# Altium schematic sheet [06] - ADC.SchDoc
size A4; DocumentNumber: 7; SheetNumber: 7; SheetTotal: 9
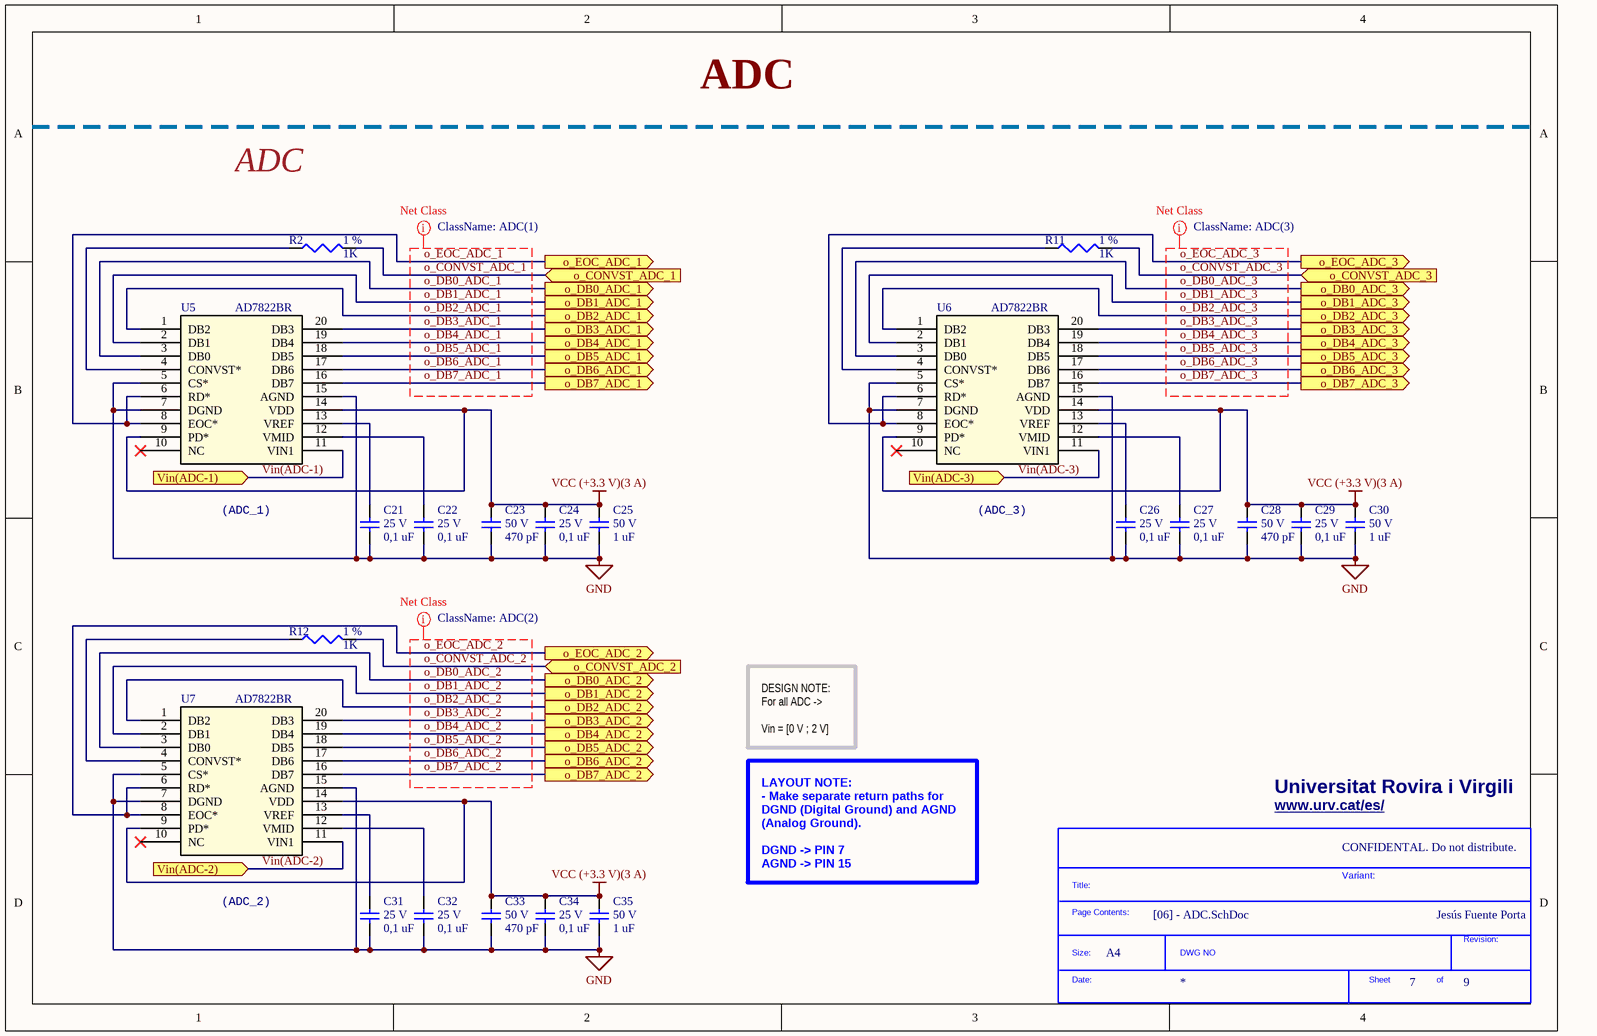
[diagram p0: [06] - ADC.SchDoc]

## Parts
*?  SDTitleBlock  (value not drawn)  (graphical)
C21  0,1 uF  Voltage: 25 V  [1206 [Métrica 3216]]
C22  0,1 uF  Voltage: 25 V  [1206 [Métrica 3216]]
C23  470 pF  Voltage: 50 V  [1206 [Métrica 3216]]
C24  0,1 uF  Voltage: 25 V  [1206 [Métrica 3216]]
C25  1 uF  Voltage: 50 V  [1206 [Métrica 3216]]
C26  0,1 uF  Voltage: 25 V  [1206 [Métrica 3216]]
C27  0,1 uF  Voltage: 25 V  [1206 [Métrica 3216]]
C28  470 pF  Voltage: 50 V  [1206 [Métrica 3216]]
C29  0,1 uF  Voltage: 25 V  [1206 [Métrica 3216]]
C30  1 uF  Voltage: 50 V  [1206 [Métrica 3216]]
C31  0,1 uF  Voltage: 25 V  [1206 [Métrica 3216]]
C32  0,1 uF  Voltage: 25 V  [1206 [Métrica 3216]]
C33  470 pF  Voltage: 50 V  [1206 [Métrica 3216]]
C34  0,1 uF  Voltage: 25 V  [1206 [Métrica 3216]]
C35  1 uF  Voltage: 50 V  [1206 [Métrica 3216]]
R2  1 %  value 1K  [1206 [Métrica 3216]]
R11  1 %  value 1K  [1206 [Métrica 3216]]
R12  1 %  value 1K  [1206 [Métrica 3216]]
U5  AD7822BR  [RW_20-M (AD7822BR)]
U6  AD7822BR  [RW_20-M (AD7822BR)]
U7  AD7822BR  [RW_20-M (AD7822BR)]

## Ports
o_CONVST_ADC_1 (in), o_CONVST_ADC_2 (in), o_CONVST_ADC_3 (in), o_DB0_ADC_1 (out), o_DB0_ADC_2 (out), o_DB0_ADC_3 (out), o_DB1_ADC_1 (out), o_DB1_ADC_2 (out), o_DB1_ADC_3 (out), o_DB2_ADC_1 (out), o_DB2_ADC_2 (out), o_DB2_ADC_3 (out), o_DB3_ADC_1 (out), o_DB3_ADC_2 (out), o_DB3_ADC_3 (out), o_DB4_ADC_1 (out), o_DB4_ADC_2 (out), o_DB4_ADC_3 (out), o_DB5_ADC_1 (out), o_DB5_ADC_2 (out), o_DB5_ADC_3 (out), o_DB6_ADC_1 (out), o_DB6_ADC_2 (out), o_DB6_ADC_3 (out), o_DB7_ADC_1 (out), o_DB7_ADC_2 (out), o_DB7_ADC_3 (out), o_EOC_ADC_1 (out), o_EOC_ADC_2 (out), o_EOC_ADC_3 (out), Vin(ADC-1) (in), Vin(ADC-2) (in), Vin(ADC-3) (in)

## Nets
GND: C21.2 C22.2 C23.2 C24.2 C25.2 C26.2 C27.2 C28.2 C29.2 C30.2 C31.2 C32.2 C33.2 C34.2 C35.2 U5.5(CS*) U5.7(DGND) U5.15(AGND) U6.5(CS*) U6.7(DGND) U6.15(AGND) U7.5(CS*) U7.7(DGND) U7.15(AGND)
VCC (+3.3 V)(3 A): C23.1 C24.1 C25.1 C28.1 C29.1 C30.1 C33.1 C34.1 C35.1 U5.9(PD*) U5.14(VDD) U6.9(PD*) U6.14(VDD) U7.9(PD*) U7.14(VDD)
o_CONVST_ADC_1: R2.2 ; port o_CONVST_ADC_1
o_CONVST_ADC_2: R12.2 ; port o_CONVST_ADC_2
o_CONVST_ADC_3: R11.2 ; port o_CONVST_ADC_3
o_DB0_ADC_1: U5.3(DB0) ; port o_DB0_ADC_1
o_DB0_ADC_2: U7.3(DB0) ; port o_DB0_ADC_2
o_DB0_ADC_3: U6.3(DB0) ; port o_DB0_ADC_3
o_DB1_ADC_1: U5.2(DB1) ; port o_DB1_ADC_1
o_DB1_ADC_2: U7.2(DB1) ; port o_DB1_ADC_2
o_DB1_ADC_3: U6.2(DB1) ; port o_DB1_ADC_3
o_DB2_ADC_1: U5.1(DB2) ; port o_DB2_ADC_1
o_DB2_ADC_2: U7.1(DB2) ; port o_DB2_ADC_2
o_DB2_ADC_3: U6.1(DB2) ; port o_DB2_ADC_3
o_DB3_ADC_1: U5.20(DB3) ; port o_DB3_ADC_1
o_DB3_ADC_2: U7.20(DB3) ; port o_DB3_ADC_2
o_DB3_ADC_3: U6.20(DB3) ; port o_DB3_ADC_3
o_DB4_ADC_1: U5.19(DB4) ; port o_DB4_ADC_1
o_DB4_ADC_2: U7.19(DB4) ; port o_DB4_ADC_2
o_DB4_ADC_3: U6.19(DB4) ; port o_DB4_ADC_3
o_DB5_ADC_1: U5.18(DB5) ; port o_DB5_ADC_1
o_DB5_ADC_2: U7.18(DB5) ; port o_DB5_ADC_2
o_DB5_ADC_3: U6.18(DB5) ; port o_DB5_ADC_3
o_DB6_ADC_1: U5.17(DB6) ; port o_DB6_ADC_1
o_DB6_ADC_2: U7.17(DB6) ; port o_DB6_ADC_2
o_DB6_ADC_3: U6.17(DB6) ; port o_DB6_ADC_3
o_DB7_ADC_1: U5.16(DB7) ; port o_DB7_ADC_1
o_DB7_ADC_2: U7.16(DB7) ; port o_DB7_ADC_2
o_DB7_ADC_3: U6.16(DB7) ; port o_DB7_ADC_3
o_EOC_ADC_1: U5.6(RD*) U5.8(EOC*) ; port o_EOC_ADC_1
o_EOC_ADC_2: U7.6(RD*) U7.8(EOC*) ; port o_EOC_ADC_2
o_EOC_ADC_3: U6.6(RD*) U6.8(EOC*) ; port o_EOC_ADC_3
Vin(ADC-1): U5.11(VIN1) ; port Vin(ADC-1)
Vin(ADC-2): U7.11(VIN1) ; port Vin(ADC-2)
Vin(ADC-3): U6.11(VIN1) ; port Vin(ADC-3)
NetC21_1: C21.1 U5.13(VREF)
NetC22_1: C22.1 U5.12(VMID)
NetC26_1: C26.1 U6.13(VREF)
NetC27_1: C27.1 U6.12(VMID)
NetC31_1: C31.1 U7.13(VREF)
NetC32_1: C32.1 U7.12(VMID)
NetR2_1: R2.1 U5.4(CONVST*)
NetR11_1: R11.1 U6.4(CONVST*)
NetR12_1: R12.1 U7.4(CONVST*)

Not connected (* = marked no-connect by the designer): U5 10(NC)*; U6 10(NC)*; U7 10(NC)*

## Layout directives
net class ADC(1): o_CONVST_ADC_1, o_DB0_ADC_1, o_DB1_ADC_1, o_DB2_ADC_1, o_DB3_ADC_1, o_DB4_ADC_1, o_DB5_ADC_1, o_DB6_ADC_1, o_DB7_ADC_1, o_EOC_ADC_1
net class ADC(2): o_CONVST_ADC_2, o_DB0_ADC_2, o_DB1_ADC_2, o_DB2_ADC_2, o_DB3_ADC_2, o_DB4_ADC_2, o_DB5_ADC_2, o_DB6_ADC_2, o_DB7_ADC_2, o_EOC_ADC_2
net class ADC(3): o_CONVST_ADC_3, o_DB0_ADC_3, o_DB1_ADC_3, o_DB2_ADC_3, o_DB3_ADC_3, o_DB4_ADC_3, o_DB5_ADC_3, o_DB6_ADC_3, o_DB7_ADC_3, o_EOC_ADC_3

## Notes on the sheet
- ADC
- ClassName: ADC(1)
- ClassName: ADC(3)
- (ADC_1)
- (ADC_3)
- ClassName: ADC(2)
- DESIGN NOTE:
  For all ADC ->
  Vin = [0 V ; 2 V]
- Universitat Rovira i Virgili
- www.urv.cat/es/ <http://www.urv.cat/es/>
- CONFIDENTAL. Do not distribute.
- (ADC_2)
- LAYOUT NOTE:
  - Make separate return paths for DGND (Digital Ground) and AGND (Analog Ground).
  DGND -> PIN 7
  AGND -> PIN 15
- Variant:
- Jesús Fuente Porta
- A4
- (in symbol SDTitleBlock) Title:; Page Contents:; Revision:; Size:; DWG NO; Date:; Sheet; of

## Library data of the parts
C21 C22 C24 C26 C27 C29 C31 C32 C34 = C0,1uF: VJ1206Y104KXXCW1BC -  Condensador de Cerámica Multicapa, 0.1 µF, 25 V, 1206 [Métrica 3216], ± 10%, X7R, VJ Series; ComponentLink1Description: Farnell Webpage; ComponentLink1URL: https://es.farnell.com/vishay/vj1206y104kxxcw1bc/conden-0-1-f-25v-10-x7r-1206/dp/2896645
C23 C28 C33 = C470pF: VJ1206A471JXACW1BC -  Condensador de Cerámica Multicapa, 470 pF, 50 V, 1206 [Métrica 3216], ± 5%, C0G / NP0, VJ Series; ComponentLink1Description: Farnell Webpage; ComponentLink1URL: https://es.farnell.com/vishay/vj1206a471jxacw1bc/conden-470pf-50v-5-c0g-np0-1206/dp/2896616
C25 C30 C35 = C1uF: MC1206B105K500CT -  Condensador de Cerámica Multicapa, 1 µF, 50 V, 1206 [Métrica 3216], ± 10%, X7R, Serie MC; ComponentLink1Description: Farnell Webpage; ComponentLink1URL: https://es.farnell.com/multicomp/mcsh31b105k500ct/conden-1-f-50v-10-x7r-1206/dp/1856643
R2 R11 R12 = Res3: MCWR12X1001FTL -  Resistencia SMD de Tipo Chip, Película Gruesa, 1206 [Métrica 3216], 1 kohm, Serie MCWR, 200 V; Published: 8-Jun-2000; LatestRevisionDate: 29-May-2009; LatestRevisionNote: IPC-7351 Footprint Added.; PackageReference: J1-0603; Publisher: Altium Limited; PackageDescription: Chip Resistor; ComponentLink1Description: Farnell Webpage; ComponentLink1URL: https://es.farnell.com/multicomp/mcwr12x1001ftl/res-1k-1-0-25w-1206-pel-c-gruesa/dp/2447473
U5-U7 = AD7822BR: 1-Channel Single ADC Semiflash 2Msps 8-bit Parallel 20-Pin SOIC W Tube; Vendor: Analog Devices Inc; Built_By: EMA_UL_Team; C: Copyright (C) 2015 Accelerated Designs. All rights reserved; Manufacturer_Part_Number: AD7822BR; RefDes: RefDes; Type: DEV; Value: Value; ComponentLink1Description: Arrow Webpage; ComponentLink1URL: https://www.arrow.com/es-mx/products/ad7822br/analog-devices; ComponentLink2Description: RS webpage (Different Footprint but equivalent functionality); ComponentLink2URL: https://es.rs-online.com/web/p/convertidores-analogico-a-digital-para-uso-general/5384656/